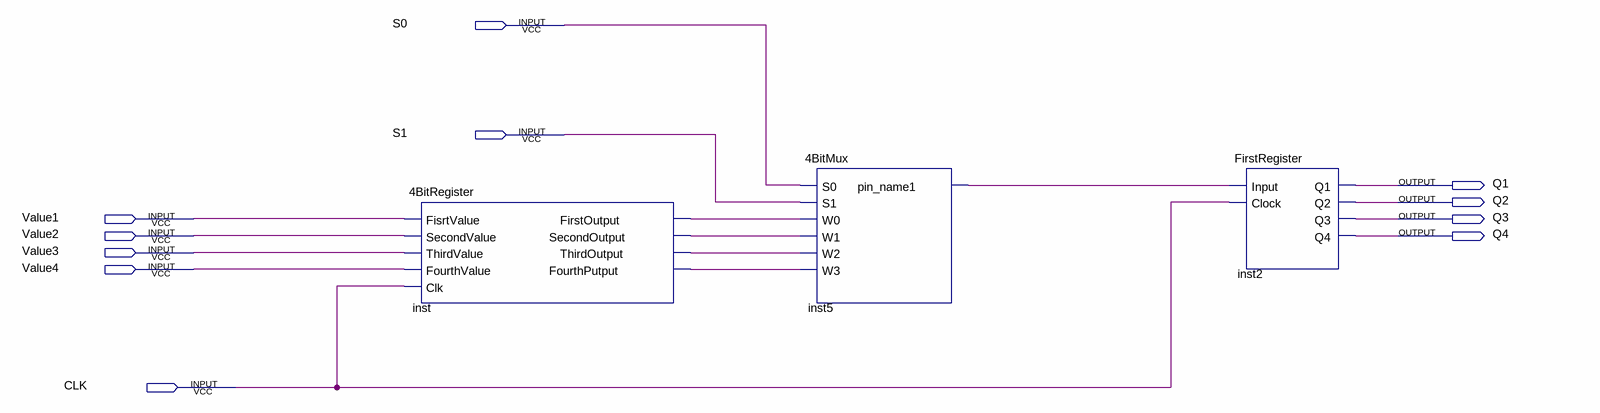
[diagram p0: schematic sheet]
// Quartus schematic RBits.bdf as structural Verilog: 3 symbols, 11 pins
module RBits (
  input  S0,
  input  S1,
  input  Value1,
  input  Value2,
  input  Value3,
  input  Value4,
  input  CLK,
  output Q1,
  output Q2,
  output Q3,
  output Q4
);

  wire inst5_pin_name1, inst_firstoutput, inst_fourthputput, inst_secondoutput, inst_thirdoutput;

  \4BitRegister  inst (
    .FisrtValue(Value1), .SecondValue(Value2), .ThirdValue(Value3), .FourthValue(Value4), .Clk(CLK),
    .FirstOutput(inst_firstoutput), .SecondOutput(inst_secondoutput), .ThirdOutput(inst_thirdoutput),
    .FourthPutput(inst_fourthputput));
  \4BitMux  inst5 (
    .S0(S0), .S1(S1), .W0(inst_firstoutput), .W1(inst_secondoutput), .W2(inst_thirdoutput),
    .W3(inst_fourthputput), .pin_name1(inst5_pin_name1));
  FirstRegister inst2 (.Input(inst5_pin_name1), .Clock(CLK), .Q1(Q1), .Q2(Q2), .Q3(Q3), .Q4(Q4));
endmodule
